# EAGLE schematic main-board (EAGLE 9.5.0)
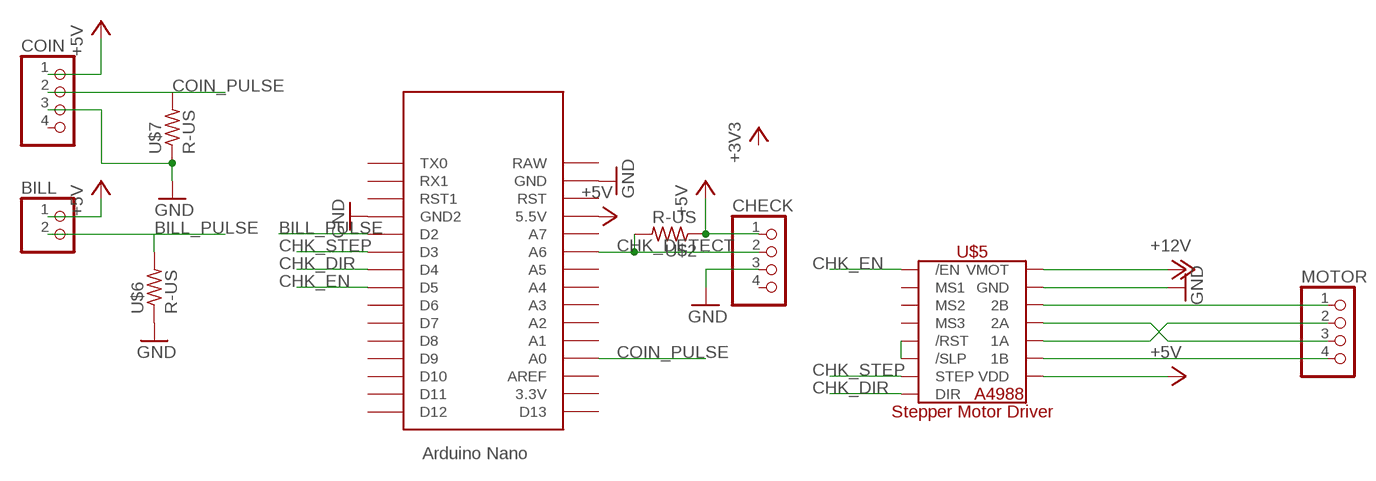
[diagram p0: schematic, sheet 1]

## Parts
BILL  PINHD-1X2  [1X02]
CHECK  PINHD-1X4  [1X04]
COIN  PINHD-1X4  [1X04]
MOTOR  PINHD-1X4  [1X04]
U$1  NANO  [NANO]
U$2  R-US  [0204/7]
U$5  A4988_STEP  [A4988_STEP]
U$6  R-US  [0204/7]
U$7  R-US  [0204/7]

## Nets
+5V: BILL.1 CHECK.1 COIN.1 U$1.5V(5.5V) U$2.1 U$5.VDD
+12V: U$5.VMOT
BILL_PULSE: BILL.2 U$1.D2 U$6.2
CHK_DETECT: CHECK.2 U$1.A6 U$2.2
CHK_DIR: U$1.D4 U$5.DIR
CHK_EN: U$1.D5 U$5./EN
CHK_STEP: U$1.D3 U$5.STEP
COIN_PULSE: COIN.2 U$1.A0 U$7.2
GND: CHECK.3 COIN.3 U$1.GND U$1.GND1(GND2) U$5.GND U$5.GND2(GND) U$6.1 U$7.1
N$1: MOTOR.2 U$5.1A
N$2: MOTOR.3 U$5.2A
N$4: MOTOR.1 U$5.2B
N$7: MOTOR.4 U$5.1B
N$11: U$5./RST U$5./SLP
Unconnected: CHECK.4 COIN.4 U$1.3.3V U$1.A1 U$1.A2 U$1.A3 U$1.A4 U$1.A5 U$1.A7 U$1.AREF U$1.D6 U$1.D7 U$1.D8 U$1.D9 U$1.D10 U$1.D11 U$1.D12 U$1.D13 U$1.ICSP1 U$1.ICSP2 U$1.ICSP3 U$1.ICSP4 U$1.ICSP5 U$1.ICSP6 U$1.RAW U$1.RST U$1.RST1 U$1.RX1 U$1.TX0 U$5.MS1 U$5.MS2 U$5.MS3

## Library data of the parts
BILL = mcp:PINHD-1X2: PIN HEADER
CHECK COIN MOTOR = mcp:PINHD-1X4: PIN HEADER
U$1 = Arduino-clone:NANO: Arduino Nano
U$2 U$6 U$7 = mcp:R-US
U$5 = IC:A4988_STEP